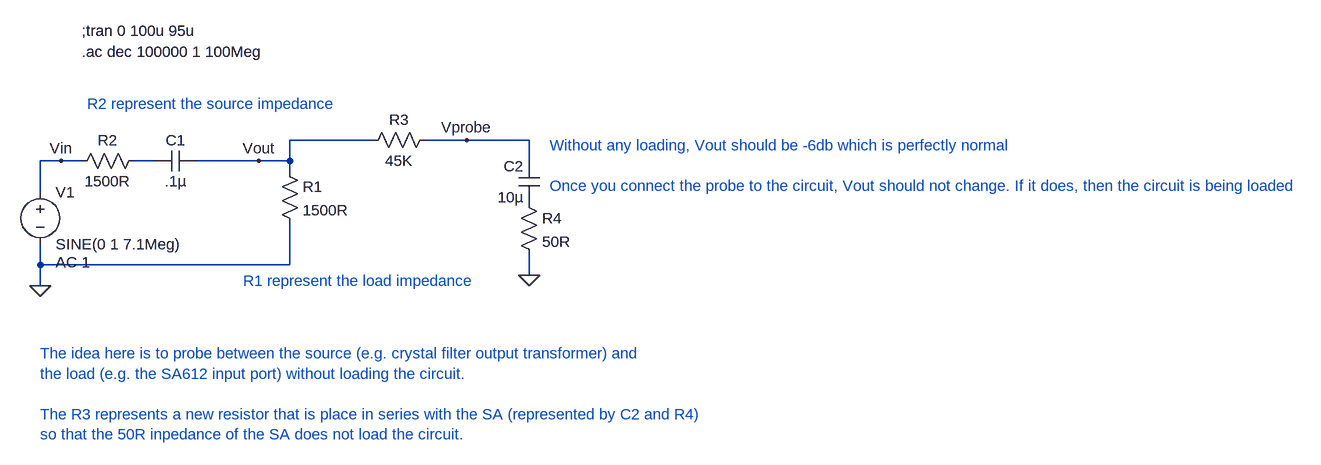
[diagram p0: schematic SA Loading Test.asc]
SA Loading Test.asc, the LTspice schematic file:
Version 4
SHEET 1 2128 680
WIRE 448 80 320 80
WIRE 592 80 528 80
WIRE 688 80 592 80
WIRE -32 112 -64 112
WIRE 0 112 -32 112
WIRE 112 112 80 112
WIRE 272 112 176 112
WIRE 320 112 320 80
WIRE 320 112 272 112
WIRE 688 112 688 80
WIRE 320 128 320 112
WIRE -64 160 -64 112
WIRE -64 272 -64 240
WIRE 320 272 320 208
WIRE 320 272 -64 272
WIRE 688 288 688 256
WIRE -64 304 -64 272
FLAG -32 112 Vin
FLAG 272 112 Vout
FLAG -64 304 0
FLAG 688 288 0
FLAG 592 80 Vprobe
SYMBOL voltage -64 144 R0
WINDOW 123 24 124 Left 2
WINDOW 39 0 0 Left 2
SYMATTR Value2 AC 1
SYMATTR InstName V1
SYMATTR Value SINE(0 1 7.1Meg)
SYMBOL cap 176 96 R90
WINDOW 0 0 32 VBottom 2
WINDOW 3 32 32 VTop 2
SYMATTR InstName C1
SYMATTR Value .1µ
SYMBOL res 304 112 R0
SYMATTR InstName R1
SYMATTR Value 1500R
SYMBOL res 96 96 R90
WINDOW 0 0 56 VBottom 2
WINDOW 3 32 56 VTop 2
SYMATTR InstName R2
SYMATTR Value 1500R
SYMBOL res 544 64 R90
WINDOW 0 0 56 VBottom 2
WINDOW 3 32 56 VTop 2
SYMATTR InstName R3
SYMATTR Value 45K
SYMBOL cap 704 176 R180
WINDOW 0 24 56 Left 2
WINDOW 3 24 8 Left 2
SYMATTR InstName C2
SYMATTR Value 10µ
SYMBOL res 672 160 R0
SYMATTR InstName R4
SYMATTR Value 50R
TEXT 0 -56 Left 2 !.ac dec 100000 1 100Meg
TEXT 0 -88 Left 2 !;tran 0 100u 95u
TEXT 8 24 Left 2 ;R2 represent the source impedance
TEXT 248 296 Left 2 ;R1 represent the load impedance
TEXT -64 408 Left 2 ;The idea here is to probe between the source (e.g. crystal filter output transformer) and\nthe load (e.g. the SA612 input port) without loading the circuit.\n \nThe R3 represents a new resistor that is place in series with the SA (represented by C2 and R4) \nso that the 50R inpedance of the SA does not load the circuit.
TEXT 720 88 Left 2 ;Without any loading, Vout should be -6db which is perfectly normal\n \nOnce you connect the probe to the circuit, Vout should not change. If it does, then the circuit is being loaded

The netlist it stands for:
* SA Loading Test.asc
V1 Vin 0 SINE(0 1 7.1Meg) AC 1
C1 Vout N001 .1µ
R1 Vout 0 1500R
R2 N001 Vin 1500R
R3 Vprobe Vout 45K
C2 P001 Vprobe 10µ
R4 P001 0 50R
.ac dec 100000 1 100Meg
;tran 0 100u 95u
* R2 represent the source impedance
* R1 represent the load impedance
* The idea here is to probe between the source (e.g. crystal filter output transformer) and
* the load (e.g. the SA612 input port) without loading the circuit.
* The R3 represents a new resistor that is place in series with the SA (represented by C2 and R4)
* so that the 50R inpedance of the SA does not load the circuit.
* Without any loading, Vout should be -6db which is perfectly normal
* Once you connect the probe to the circuit, Vout should not change. If it does, then the circuit is being loaded
.backanno
.end